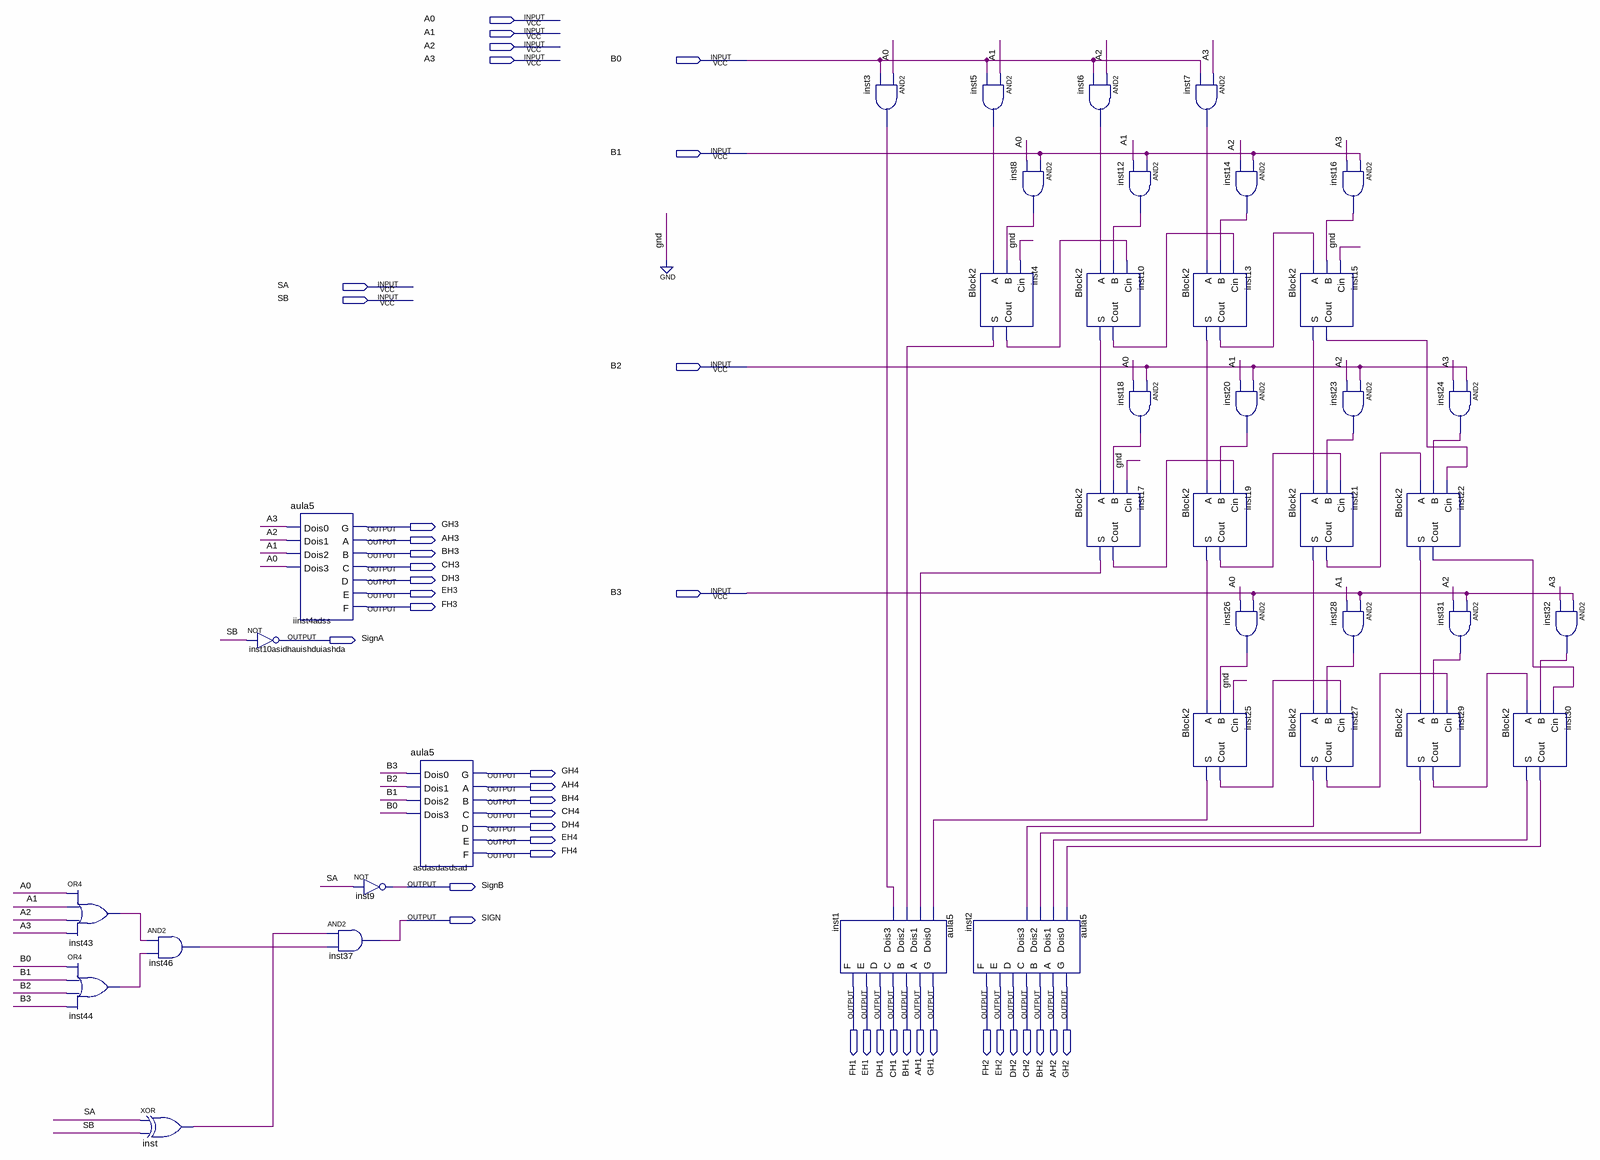
[diagram p0: schematic sheet]
// Quartus schematic aula10.bdf as structural Verilog: 39 symbols, 41 pins
module aula10 (
  input  A0,
  input  A1,
  input  A2,
  input  A3,
  input  B0,
  input  B1,
  input  SA,
  input  SB,
  input  B2,
  input  B3,
  output GH3,
  output AH3,
  output BH3,
  output CH3,
  output DH3,
  output EH3,
  output FH3,
  output SignA,
  output GH4,
  output AH4,
  output BH4,
  output CH4,
  output DH4,
  output EH4,
  output FH4,
  output SignB,
  output SIGN,
  output FH1,
  output EH1,
  output DH1,
  output CH1,
  output BH1,
  output AH1,
  output GH1,
  output FH2,
  output EH2,
  output DH2,
  output CH2,
  output BH2,
  output AH2,
  output GH2
);

  wire inst3_out, inst4_cout, inst4_s, inst5_out, inst6_out, inst7_out, inst8_out, inst10_cout, inst10_s,
       inst12_out, inst13_cout, inst13_s, inst14_out, inst15_cout, inst15_s, inst16_out, inst17_cout,
       inst17_s, inst18_out, inst19_cout, inst19_s, inst20_out, inst21_cout, inst21_s, inst22_cout, inst22_s,
       inst23_out, inst24_out, inst25_cout, inst25_s, inst26_out, inst27_cout, inst27_s, inst28_out,
       inst29_cout, inst29_s, inst30_cout, inst30_s, inst31_out, inst32_out, inst43_out, inst44_out,
       inst46_out, inst_out;

  or inst43 (inst43_out, A0, A1, A2, A3);
  or inst44 (inst44_out, B0, B1, B2, B3);
  and inst46 (inst46_out, inst43_out, inst44_out);
  xor inst (inst_out, SA, SB);
  not inst10asidhauishduiashda (SignA, SB);
  aula5 iinst4adss (
    .Dois0(A3), .Dois1(A2), .Dois2(A1), .Dois3(A0), .G(GH3), .A(AH3), .B(BH3), .C(CH3), .D(DH3), .E(EH3),
    .F(FH3));
  not inst9 (SignB, SA);
  and inst37 (SIGN, inst_out, inst46_out);
  aula5 asdasdasdsad (
    .Dois0(B3), .Dois1(B2), .Dois2(B1), .Dois3(B0), .G(GH4), .A(AH4), .B(BH4), .C(CH4), .D(DH4), .E(EH4),
    .F(FH4));
  aula5 inst1 (
    .Dois0(inst25_s), .Dois1(inst17_s), .Dois2(inst4_s), .Dois3(inst3_out), .G(GH1), .A(AH1), .B(BH1),
    .C(CH1), .D(DH1), .E(EH1), .F(FH1));
  and inst3 (inst3_out, A0, B0);
  and inst5 (inst5_out, A1, B0);
  Block2 inst4 (.A(inst5_out), .B(inst8_out), .Cin(1'b0), .S(inst4_s), .Cout(inst4_cout));
  aula5 inst2 (
    .Dois0(inst30_cout), .Dois1(inst30_s), .Dois2(inst29_s), .Dois3(inst27_s), .G(GH2), .A(AH2), .B(BH2),
    .C(CH2), .D(DH2), .E(EH2), .F(FH2));
  and inst8 (inst8_out, B1, A0);
  and inst6 (inst6_out, A2, B0);
  Block2 inst10 (.A(inst6_out), .B(inst12_out), .Cin(inst4_cout), .S(inst10_s), .Cout(inst10_cout));
  Block2 inst17 (.A(inst10_s), .B(inst18_out), .Cin(1'b0), .S(inst17_s), .Cout(inst17_cout));
  and inst12 (inst12_out, B1, A1);
  and inst18 (inst18_out, B2, A0);
  and inst7 (inst7_out, A3, B0);
  Block2 inst13 (.A(inst7_out), .B(inst14_out), .Cin(inst10_cout), .S(inst13_s), .Cout(inst13_cout));
  Block2 inst19 (.A(inst13_s), .B(inst20_out), .Cin(inst17_cout), .S(inst19_s), .Cout(inst19_cout));
  Block2 inst25 (.A(inst19_s), .B(inst26_out), .Cin(1'b0), .S(inst25_s), .Cout(inst25_cout));
  and inst14 (inst14_out, B1, A2);
  and inst20 (inst20_out, B2, A1);
  and inst26 (inst26_out, B3, A0);
  Block2 inst15 (.A(inst13_cout), .B(inst16_out), .Cin(1'b0), .S(inst15_s), .Cout(inst15_cout));
  Block2 inst21 (.A(inst15_s), .B(inst23_out), .Cin(inst19_cout), .S(inst21_s), .Cout(inst21_cout));
  Block2 inst27 (.A(inst21_s), .B(inst28_out), .Cin(inst25_cout), .S(inst27_s), .Cout(inst27_cout));
  and inst16 (inst16_out, B1, A3);
  and inst23 (inst23_out, B2, A2);
  and inst28 (inst28_out, B3, A1);
  Block2 inst22 (.A(inst21_cout), .B(inst24_out), .Cin(inst15_cout), .S(inst22_s), .Cout(inst22_cout));
  Block2 inst29 (.A(inst22_s), .B(inst31_out), .Cin(inst27_cout), .S(inst29_s), .Cout(inst29_cout));
  and inst24 (inst24_out, B2, A3);
  and inst31 (inst31_out, B3, A2);
  Block2 inst30 (.A(inst29_cout), .B(inst32_out), .Cin(inst22_cout), .S(inst30_s), .Cout(inst30_cout));
  and inst32 (inst32_out, B3, A3);
endmodule
